# EAGLE design ESP32-XTonUINO_Buttons (EAGLE 6.6.0)
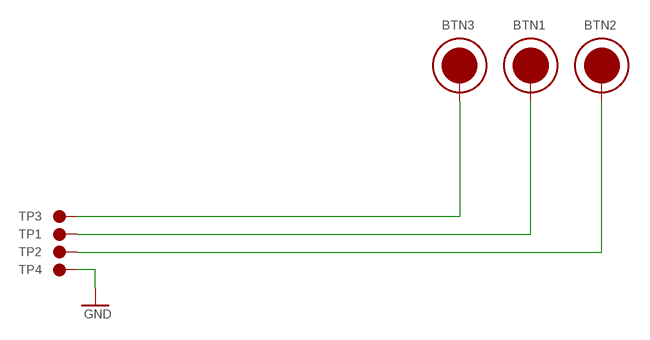
[diagram p0: schematic, sheet 1]

## Parts
BTN1  TOUCHBTN  [TOUCHBTN]
BTN2  TOUCHBTN  [TOUCHBTN]
BTN3  TOUCHBTN  [TOUCHBTN]
TP1  TESTPINL  [TESTPAD_L]
TP2  TESTPINL  [TESTPAD_L]
TP3  TESTPINL  [TESTPAD_L]
TP4  TESTPINL  [TESTPAD_L]

## Nets
GND: TP4.TP
N$1: BTN3.BTN TP3.TP
N$2: BTN1.BTN TP1.TP
N$3: BTN2.BTN TP2.TP

## Library data of the parts
BTN1-BTN3 = dl9sec_public:TOUCHBTN: Touch button 7mm
TP1-TP4 = dl9sec_public:TESTPIN: Testpin/Testpad

## Board
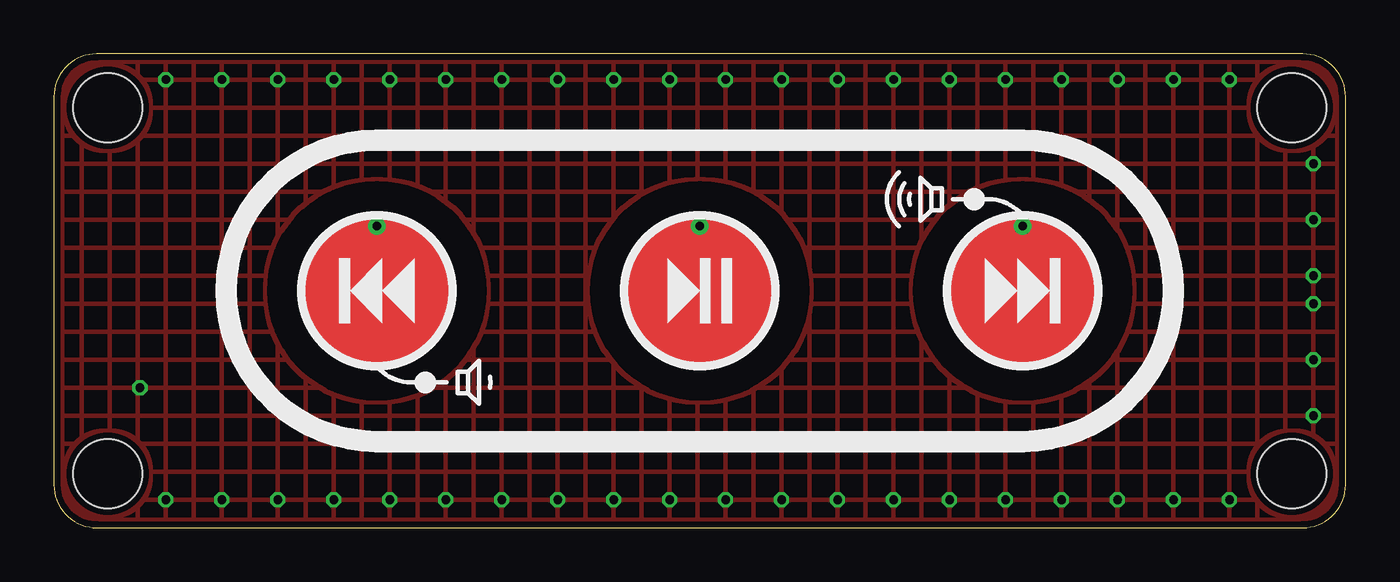
[diagram p1: board, top side]
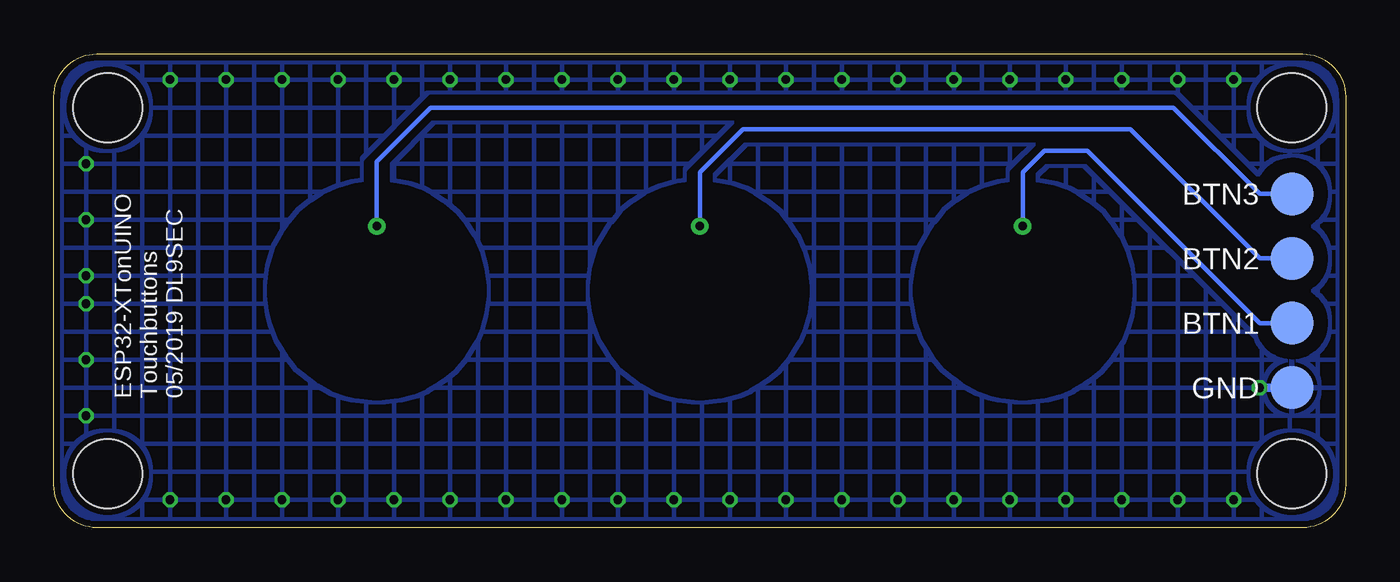
[diagram p2: board, bottom side, seen from below]

Size 60 x 22 mm. Coordinates in mm from the lower left corner, seen from the top.
Outline: 58,22 2,22 arc90 0,20 0,2 arc90 2,0 58,0 arc90 60,2 60,20 arc90 58,22
Copper layers (1*16): Top 0.035mm / dielectric 1.5mm / Bottom 0.035mm
Design rules "PCB-POOL Standard_tg": minimum track width 0.15mm, minimum drill 0.3mm, track to track 0.15mm, track to pad 0.15mm, pad to pad 0.15mm, via to via 0.15mm, smd to smd 0.15mm, copper to edge 0.3mm, drill to drill 0.2mm, minimum pad ring 0.2mm, minimum via ring 0.15mm, stop-mask expansion 0.075mm, vias tented up to drill 0.5mm, thermal gap 0.2mm
Holes 3.2 mm at 2.5,19.5 2.5,2.5 57.5,19.5 57.5,2.5
bRestrict: 29 lines

### Footprints (pad centres in the part's own frame; a part is rotated, then mirrored left to right if it is on the bottom)
TOUCHBTN = drill 0.4: BTN 0,3
TESTPAD_L = smd 2 x 2: TP 0,0

### Placement (x,y rotation side)
BTN1  30,11 0 top
BTN2  45,11 0 top
BTN3  15,11 0 top
TP1  2.5,12.5 0 bottom
TP2  2.5,15.5 0 bottom
TP3  2.5,9.5 0 bottom
TP4  2.5,6.5 0 bottom

### Tracks (layer width: path | path; a pad name or v marks a point on that pad's centre or on a via)
GND  (via drill 0.4)
  Bottom 0.4: TP4.TP v4,6.5
  other vias: 5.2,1.3 7.8,1.3 10.4,1.3 13,1.3 15.6,1.3 18.2,1.3 20.8,1.3 23.4,1.3 26,1.3 28.6,1.3 31.2,1.3 33.8,1.3 36.4,1.3 39,1.3 41.6,1.3 44.2,1.3 46.8,1.3 49.4,1.3 52,1.3 54.6,1.3 58.5,5.2 58.5,7.8 54.6,20.8 52,20.8 49.4,20.8 46.8,20.8 44.2,20.8 41.6,20.8 39,20.8 36.4,20.8 33.8,20.8 31.2,20.8 28.6,20.8 26,20.8 23.4,20.8 20.8,20.8 18.2,20.8 15.6,20.8 13,20.8 10.4,20.8 7.8,20.8 5.2,20.8 58.5,16.9 58.5,14.3 58.5,11.7 58.5,10.4
  pour Top (hatched): 58,22 2,22 arc90 0,20 0,2 arc90 2,0 58,0 arc90 60,2 60,20 arc90
  pour Bottom (hatched): 58,22 2,22 arc90 0,20 0,2 arc90 2,0 58,0 arc90 60,2 60,20 arc90
N$1
  Bottom 0.2: BTN3.BTN 15,16.5 14,17.5 12,17.5 4,9.5 TP3.TP
N$2
  Bottom 0.2: TP1.TP 4,12.5 10,18.5 28,18.5 30,16.5 BTN1.BTN
N$3
  Bottom 0.2: BTN2.BTN 45,17 42.5,19.5 8,19.5 4,15.5 TP2.TP

### Text on the board
bPlace: BTN3 | BTN2 | BTN1 | GND | ESP32-XTonUINO / Touchbuttons / 05/2019 DL9SEC